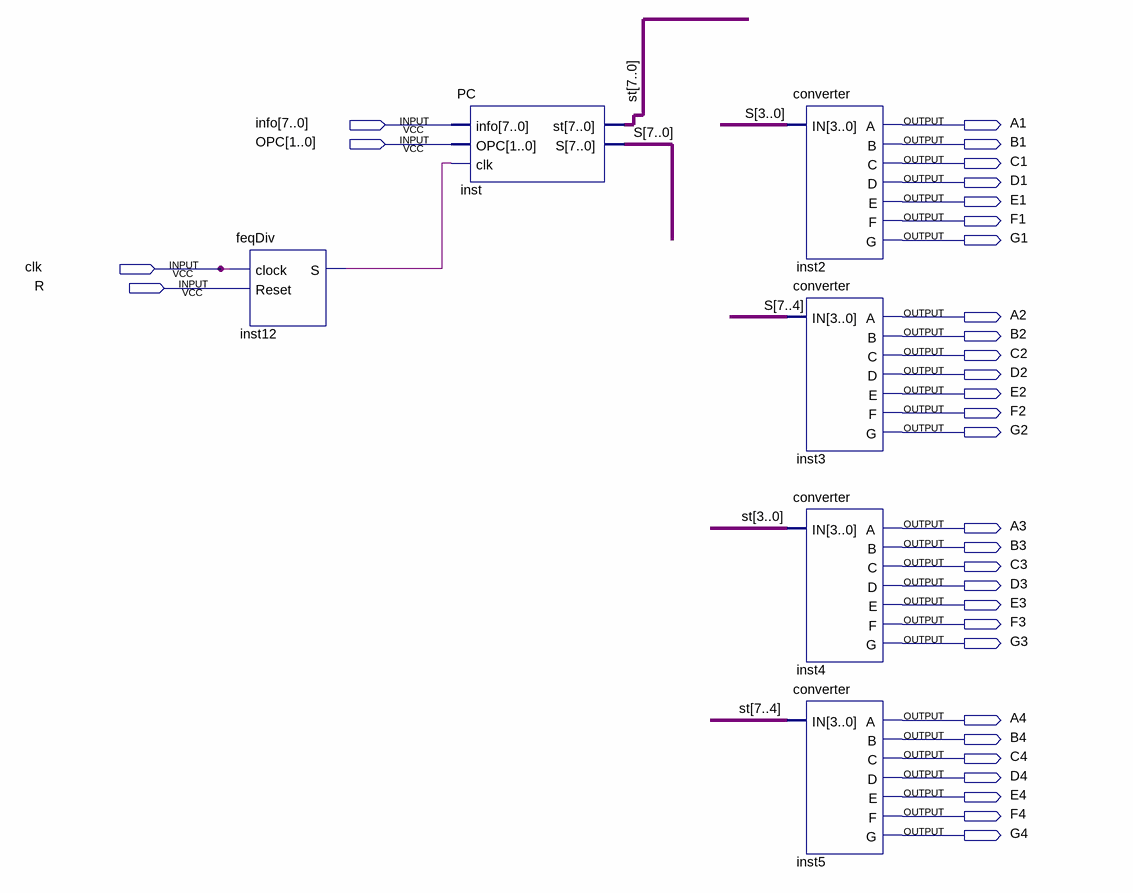
[diagram p0: schematic sheet]
// Quartus schematic counterWS.bdf as structural Verilog: 6 symbols, 32 pins
module counterWS (
  input  [7:0] info,
  input  [1:0] OPC,
  input  clk,
  input  R,
  output A1,
  output B1,
  output C1,
  output D1,
  output E1,
  output F1,
  output G1,
  output A2,
  output B2,
  output C2,
  output D2,
  output E2,
  output F2,
  output G2,
  output A3,
  output B3,
  output C3,
  output D3,
  output E3,
  output F3,
  output G3,
  output A4,
  output B4,
  output C4,
  output D4,
  output E4,
  output F4,
  output G4
);

  wire inst12_s;
  wire [7:0] S, st;

  feqDiv inst12 (.clock(clk), .Reset(R), .S(inst12_s));
  PC inst (.info(info), .OPC(OPC), .clk(inst12_s), .st(st), .S(S));
  converter inst2 (.IN(S[3:0]), .A(A1), .B(B1), .C(C1), .D(D1), .E(E1), .F(F1), .G(G1));
  converter inst3 (.IN(S[7:4]), .A(A2), .B(B2), .C(C2), .D(D2), .E(E2), .F(F2), .G(G2));
  converter inst4 (.IN(st[3:0]), .A(A3), .B(B3), .C(C3), .D(D3), .E(E3), .F(F3), .G(G3));
  converter inst5 (.IN(st[7:4]), .A(A4), .B(B4), .C(C4), .D(D4), .E(E4), .F(F4), .G(G4));
endmodule
